# EAGLE design Main Board (EAGLE 5.11)
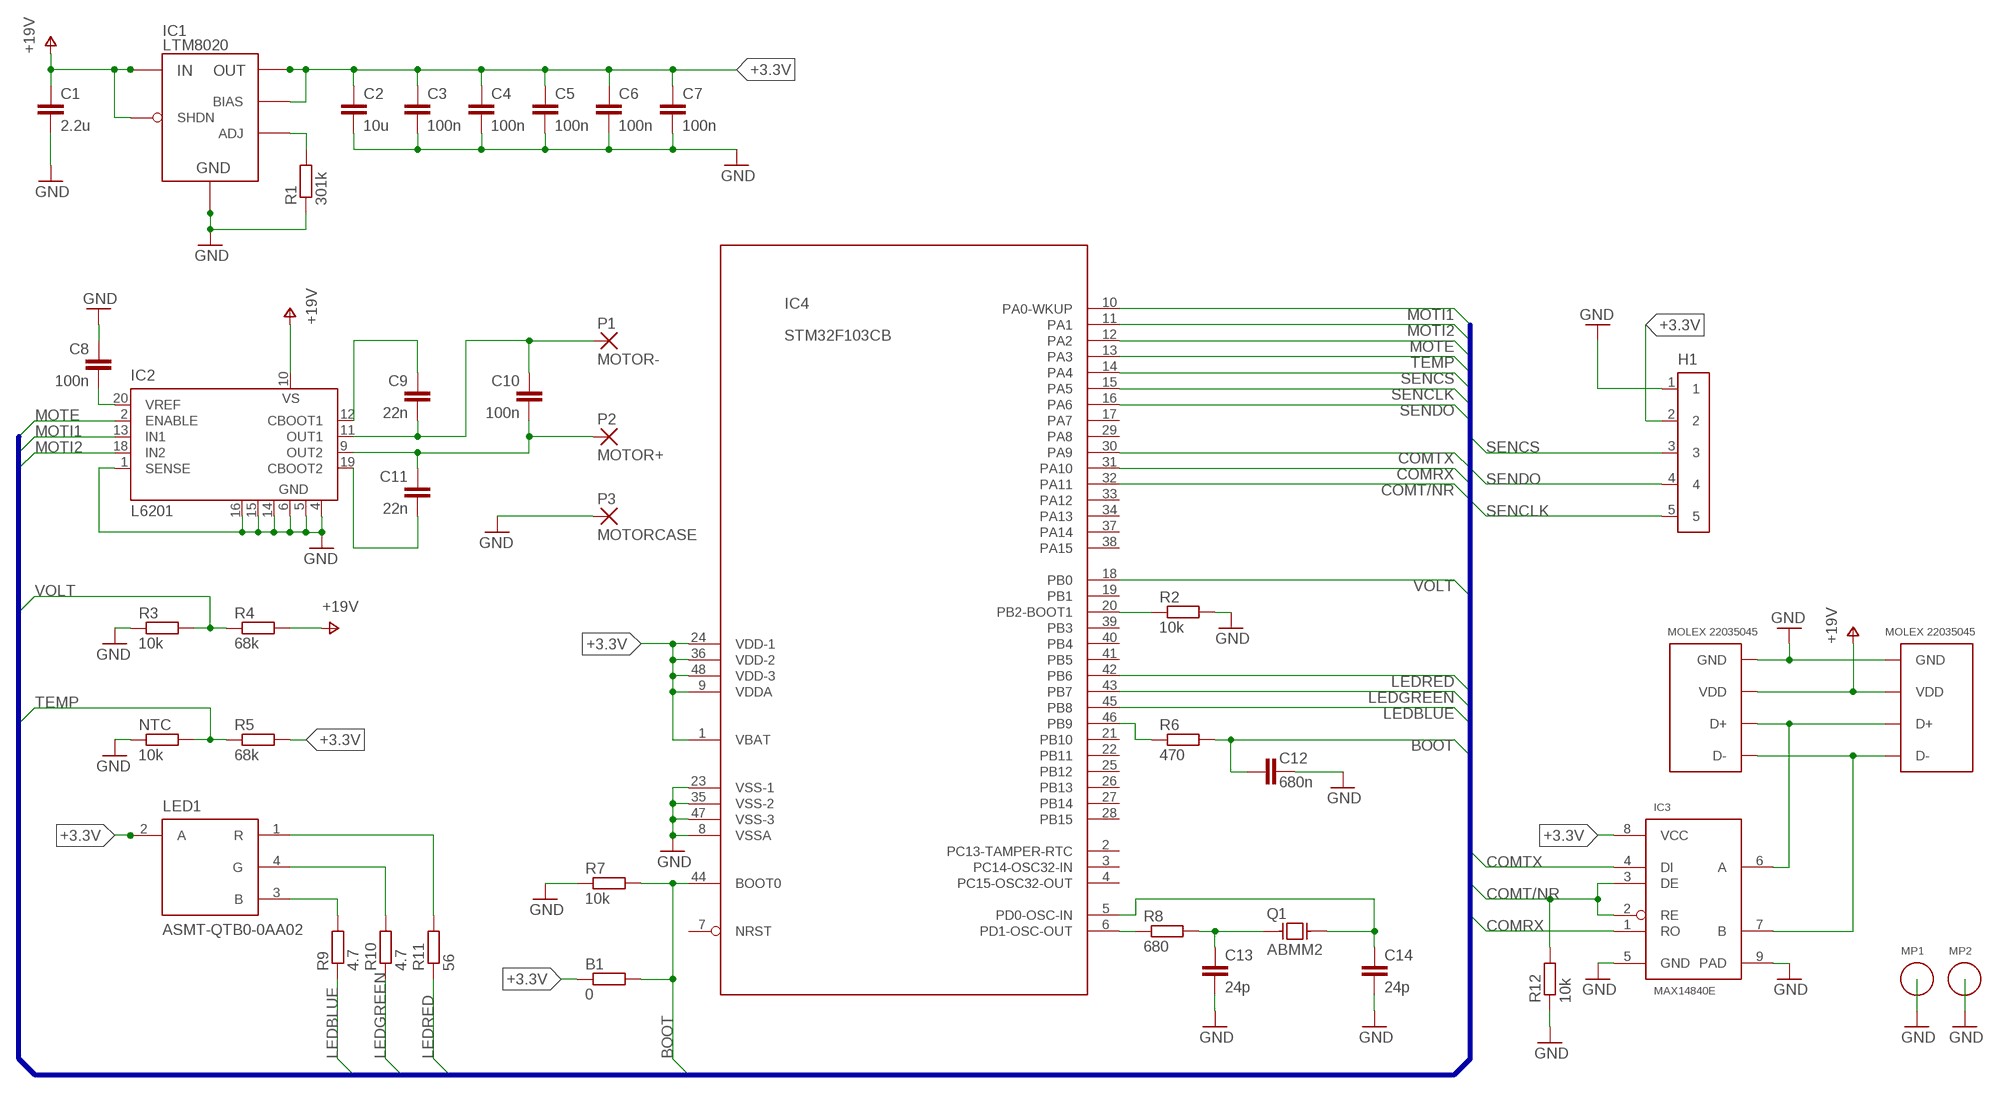
[diagram p0: schematic, sheet 1]

## Parts
B1  0  R-EU_R0603  [R0603]
C1  2.2u  C-EUC1206  [C1206]
C2  10u  C-EUC1206  [C1206]
C3  100n  C-EUC0402  [C0402]
C4  100n  C-EUC0402  [C0402]
C5  100n  C-EUC0402  [C0402]
C6  100n  C-EUC0402  [C0402]
C7  100n  C-EUC0402  [C0402]
C8  100n  C-EUC0402  [C0402]
C9  22n  C-EUC0402  [C0402]
C10  100n  C-EUC1206K  [C1206K]
C11  22n  C-EUC0402  [C0402]
C12  680n  C-EUC0603  [C0603]
C13  24p  C-EUC0402  [C0402]
C14  24p  C-EUC0402  [C0402]
H1  HEADER-M52  [HEADER-M52]
IC1  LTM8020  [LGA21]
IC2  L6201  [SO20]
IC3  MAX14840E  [TDFN8]
IC4  STM32F103CB  [LQFP48]
LED1  ASMT-QTB0-0AA02  [PLCC4]
MP1  MOUNTINGPAD-28  [PAD-2X4-ROUND]
MP2  MOUNTINGPAD-28  [PAD-2X4-ROUND]
NTC  10k  R-EU_R0603  [R0603]
P1  MOTOR-  PAD-2X3  [PAD-2X3]
P2  MOTOR+  PAD-2X3  [PAD-2X3]
P3  MOTORCASE  PAD-2X3  [PAD-2X3]
Q1  ABMM2  [CRYSTAL-6X3.6]
R1  301k  R-EU_R0603  [R0603]
R2  10k  R-EU_R0402  [R0402]
R3  10k  R-EU_R0402  [R0402]
R4  68k  R-EU_R0402  [R0402]
R5  68k  R-EU_R0402  [R0402]
R6  470  R-EU_R0402  [R0402]
R7  10k  R-EU_R0402  [R0402]
R8  680  R-EU_R0402  [R0402]
R9  4.7  R-EU_R0402  [R0402]
R10  4.7  R-EU_R0402  [R0402]
R11  56  R-EU_R0402  [R0402]
R12  10k  R-EU_R0402  [R0402]
U1  MOLEX22035045  [MOLEX22035045]
U2  MOLEX22035045  [MOLEX22035045]

## Nets
+3.3V [lowpower]: B1.1 C2.1 C3.1 C4.1 C5.1 C6.1 C7.1 H1.2 IC1.A4(OUT) IC1.A5(OUT) IC1.B4(OUT) IC1.B5(OUT) IC1.C3(BIAS) IC1.C4(OUT) IC1.C5(OUT) IC3.8(VCC) IC4.1(VBAT) IC4.9(VDDA) IC4.24(VDD-1) IC4.36(VDD-2) IC4.48(VDD-3) LED1.2(A) LED1.SINK1(A) LED1.SINK2(A) R5.2
BOOT: B1.2 C12.2 IC4.44(BOOT0) R6.2 R7.2
COMRX: IC3.1(RO) IC4.31(PA10)
COMT/NR: IC3.2(RE) IC3.3(DE) IC4.32(PA11) R12.2
COMTX: IC3.4(DI) IC4.30(PA9)
GND [gnd]: C1.2 C2.2 C3.2 C4.2 C5.2 C6.2 C7.2 C8.1 C12.1 C13.2 C14.2 H1.1 IC1.C2(GND) IC1.D1(GND) IC1.D2(GND) IC1.D3(GND) IC1.D4(GND) IC1.D5(GND) IC1.E2(GND) IC1.E3(GND) IC1.E4(GND) IC1.E5(GND) IC2.1(SENSE) IC2.4(GND) IC2.5(GND) IC2.6(GND) IC2.14(GND) IC2.15(GND) IC2.16(GND) IC3.5(GND) IC3.9(PAD) IC4.8(VSSA) IC4.23(VSS-1) IC4.35(VSS-2) IC4.47(VSS-3) MP1.1 MP2.1 NTC.1 P3.1 R1.1 R2.2 R3.1 R7.1 R12.1 U1.GND U2.GND
LEDBLUE: IC4.45(PB8) R9.1
LEDGREEN: IC4.43(PB7) R10.1
LEDRED: IC4.42(PB6) R11.1
MOTE: IC2.2(ENABLE) IC4.12(PA2)
MOTI1: IC2.13(IN1) IC4.10(PA0-WKUP)
MOTI2: IC2.18(IN2) IC4.11(PA1)
N$1: IC4.20(PB2-BOOT1) R2.1
N$2: IC4.46(PB9) R6.1
N$3: LED1.3(B) R9.2
N$4 [lowpower]: IC1.E1(ADJ) R1.2
N$5: LED1.4(G) R10.2
N$6: LED1.1(R) R11.2
N$7: C14.1 IC4.5(PD0-OSC-IN) Q1.3
N$8: C13.1 Q1.1 R8.2
N$9: IC4.6(PD1-OSC-OUT) R8.1
N$10: C8.2 IC2.20(VREF)
N$12 [highpower]: C9.2 C10.1 IC2.11(OUT1) P1.1
N$13: IC3.7(B) U1.D- U2.D-
N$14: IC3.6(A) U1.D+ U2.D+
N$15 [lowpower]: C9.1 IC2.12(CBOOT1)
N$16 [lowpower]: C11.2 IC2.19(CBOOT2)
N$18 [highpower]: C10.2 C11.1 IC2.9(OUT2) P2.1
SENCLK: H1.5 IC4.15(PA5)
SENCS: H1.3 IC4.14(PA4)
SENDO: H1.4 IC4.16(PA6)
TEMP: IC4.13(PA3) NTC.2 R5.1
V+ [highpower]: C1.1 IC1.A1(IN) IC1.A2(IN) IC1.C1(SHDN) IC2.10(VS) R4.2 U1.VDD U2.VDD ; supply symbol labelled +19V
VOLT: IC4.18(PB0) R3.2 R4.1
Unconnected: IC4.2(PC13-TAMPER-RTC) IC4.3(PC14-OSC32-IN) IC4.4(PC15-OSC32-OUT) IC4.7(NRST) IC4.17(PA7) IC4.19(PB1) IC4.21(PB10) IC4.22(PB11) IC4.25(PB12) IC4.26(PB13) IC4.27(PB14) IC4.28(PB15) IC4.29(PA8) IC4.33(PA12) IC4.34(PA13) IC4.37(PA14) IC4.38(PA15) IC4.39(PB3) IC4.40(PB4) IC4.41(PB5)

## Buses
COMT/NR,COMTX,COMRX,MOTE,MOTI1,MOTI2,SENCS,SENCLK,SENDO,LEDRED,LEDGREEN,LEDBLUE,BOOT,TEMP,VOLT

## Library data of the parts
B1 NTC R1-R12 = rcl:R-EU_: RESISTOR, European symbol
C1-C14 = rcl:C-EU: CAPACITOR, European symbol
H1 = sim:HEADER-M52: HEADER M52
IC1 = sim:LTM8020: VOLTAGE REGULATOR LTM8020
IC2 = st-microelectronics:L620: DMOS FULL BRIDGE DRIVER
IC3 = sim:MAX14840E: TRANSCEIVER MAX14840E
IC4 = sim:STM32F103CB: CONTROLLER STM32F103CB
LED1 = sim:ASMT-QTB0-0AA02: LED RGB ASMT-QTB0-0AA02
MP1 MP2 = sim:MOUNTINGPAD-28: MOUNTING PAD FOR DD-28
P1-P3 = sim:PAD-2X3: SMD PAD 2mm x 3mm
Q1 = sim:ABMM2: CERAMIC CRYSTAL ABMM2
U1 U2 = sim:MOLEX22035045: CONNECTOR MOLEX22035045

## Net classes
0 default: width 0.15 mm, drill 0.3 mm, clearance 0.15 mm
1 motor: width 0.3 mm, drill 0.3 mm, clearance 0.15 mm
2 highpower: width 0.3 mm, drill 0.3 mm, clearance 0.15 mm
3 lowpower: width 0.15 mm, drill 0.3 mm, clearance 0.15 mm
4 gnd: width 0.15 mm, drill 0.3 mm, clearance 0.15 mm

## Board
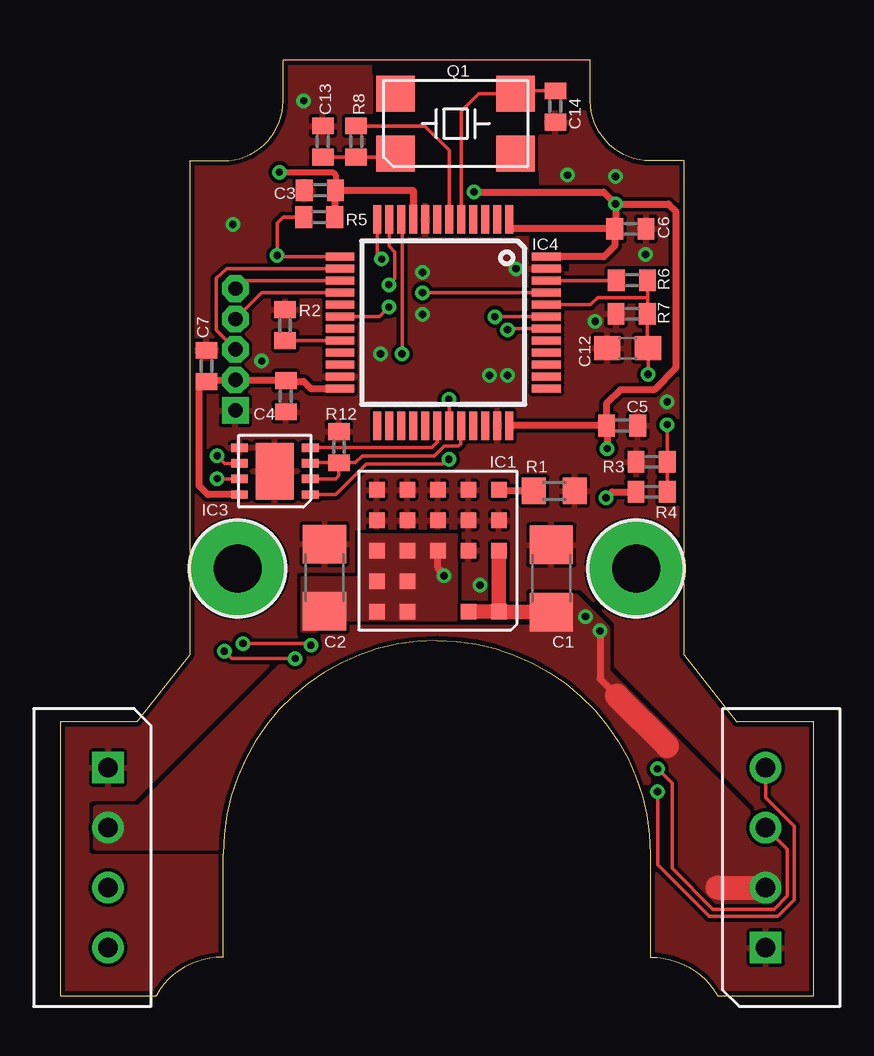
[diagram p1: board, top side]
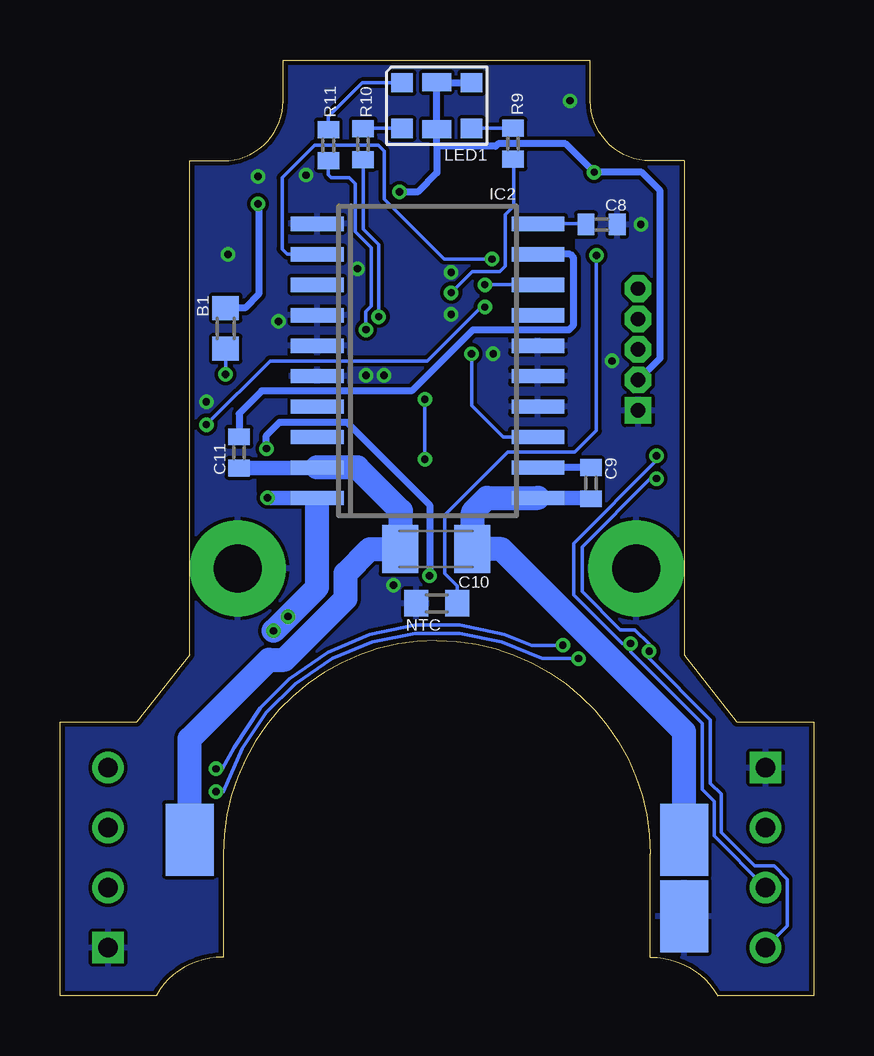
[diagram p2: board, bottom side, seen from below]

Size 31.4 x 39 mm. Coordinates in mm from the lower left corner, seen from the top.
Outline: 0,0 4,0 arc-61 6.8,1.6 6.8,5.9 arc-90 15.7,14.8 arc-90 24.6,5.9 24.6,1.6 arc-61 27.4,0 31.4,0 31.4,11.4 28.2,11.4 26,14.2 26,34.8 24.6,34.8 arc-90 22.1,37.3 22.1,39 9.3,39 9.3,37.3 arc-90 6.8,34.8 5.4,34.8 5.4,14.2 3.2,11.4 0,11.4 0,0
Copper layers (1*16): Top 0.035mm / dielectric 1.5mm / Bottom 0.035mm
Design rules "default *": minimum track width 0.15mm, minimum drill 0.3mm, track to track 0.15mm, track to pad 0.15mm, pad to pad 0.15mm, via to via 0.15mm, smd to smd 0.15mm, copper to edge 0.2mm, drill to drill 0.3mm, minimum pad ring 10mil, minimum via ring 6mil, stop-mask expansion 4mil, vias tented up to drill 0mil, thermal gap 0.15mm
tRestrict: area 10.7,33.4 to 10.8,33.8; area 15,33 to 15.4,33.1; area 24.9,30.3 to 25.4,30.4; area 23.6,30.3 to 24.1,30.4; area 20.9,30.2 to 21.2,30.4; area 12.8,35.4 to 12.9,35.8; area 19.6,31 to 19.6,31.7; area 5.8,26.3 to 6.4,26.4; area 13,38.4 to 13.1,38.8; area 20.1,36.2 to 20.1,36.6; area 19.9,33.8 to 19.9,34.3; area 12.8,36.7 to 13.2,36.8; 2 more areas
bRestrict: area 21.9,25.6 to 22.2,26; area 23.1,21 to 23.2,21.5; area 8.7,21.1 to 8.8,21.6; area 9.9,31.1 to 10.1,31.6; area 9.1,35.7 to 10.2,35.8; area 15.8,16.1 to 16,16.6

### Footprints (pad centres in the part's own frame; a part is rotated, then mirrored left to right if it is on the bottom)
R0603 = smd 1 x 1.1: 1 -0.85,0; 2 0.85,0
C1206 = smd 1.6 x 1.8: 1 -1.4,0; 2 1.4,0
C0402 = smd 0.7 x 0.9: 1 -0.65,0; 2 0.65,0
C1206K = smd 1.5 x 2: 1 -1.5,0; 2 1.5,0
C0603 = smd 1.1 x 1: 1 -0.85,0; 2 0.85,0
HEADER-M52 = drill 0.6 square: 1 -2.54,0 | drill 0.6 octagon: 2 -1.27,0; 3 0,0; 4 1.27,0; 5 2.54,0
LGA21 = smd 0.635 x 0.635: A1 2.54,-2.54; A2 1.27,-2.54; A4 -1.27,-2.54; A5 -2.54,-2.54; B4 -1.27,-1.27; B5 -2.54,-1.27; C1 2.54,0; C2 1.27,0; C3 0,0; C4 -1.27,0; C5 -2.54,0; D1 2.54,1.27; D2 1.27,1.27; D3 0,1.27; D4 -1.27,1.27; D5 -2.54,1.27; E1 2.54,2.54; E2 1.27,2.54; E3 0,2.54; E4 -1.27,2.54; E5 -2.54,2.54
SO20 = smd 0.6 x 2.2: 1 -5.715,-4.6; 2 -4.445,-4.6; 3 -3.175,-4.6; 4 -1.905,-4.6; 5 -0.635,-4.6; 6 0.635,-4.6; 7 1.905,-4.6; 8 3.175,-4.6; 9 4.445,-4.6; 10 5.715,-4.6; 11 5.715,4.6; 12 4.445,4.6; 13 3.175,4.6; 14 1.905,4.6; 15 0.635,4.6; 16 -0.635,4.6; 17 -1.905,4.6; 18 -3.175,4.6; 19 -4.445,4.6; 20 -5.715,4.6
TDFN8 = smd 0.35 x 0.7: 1 -0.975,-1.475; 2 -0.325,-1.475; 3 0.325,-1.475; 4 0.975,-1.475; 5 0.975,1.475; 6 0.325,1.475; 7 -0.325,1.475; 8 -0.975,1.475 | smd 2.35 x 1.58: 9 0,0
LQFP48 = smd 1.2 x 0.32: 1 -4.3,2.75; 2 -4.3,2.25; 3 -4.3,1.75; 4 -4.3,1.25; 5 -4.3,0.75; 6 -4.3,0.25; 7 -4.3,-0.25; 8 -4.3,-0.75; 9 -4.3,-1.25; 10 -4.3,-1.75; 11 -4.3,-2.25; 12 -4.3,-2.75; 25 4.3,-2.75; 26 4.3,-2.25; 27 4.3,-1.75; 28 4.3,-1.25; 29 4.3,-0.75; 30 4.3,-0.25; 31 4.3,0.25; 32 4.3,0.75; 33 4.3,1.25; 34 4.3,1.75; 35 4.3,2.25; 36 4.3,2.75 | smd 0.32 x 1.2: 13 -2.75,-4.3; 14 -2.25,-4.3; 15 -1.75,-4.3; 16 -1.25,-4.3; 17 -0.75,-4.3; 18 -0.25,-4.3; 19 0.25,-4.3; 20 0.75,-4.3; 21 1.25,-4.3; 22 1.75,-4.3; 23 2.25,-4.3; 24 2.75,-4.3; 37 2.75,4.3; 38 2.25,4.3; 39 1.75,4.3; 40 1.25,4.3; 41 0.75,4.3; 42 0.25,4.3; 43 -0.25,4.3; 44 -0.75,4.3; 45 -1.25,4.3; 46 -1.75,4.3; 47 -2.25,4.3; 48 -2.75,4.3
PLCC4 = smd 0.8 x 0.9: 1 -0.95,-1.45; 2 -0.95,1.45; 3 0.95,1.45; 4 0.95,-1.45 | smd 0.75 x 1.2: SINK1 -0.975,0; SINK2 0.975,0
PAD-2X4-ROUND = drill 2 pad 4 round: 1 0,0
PAD-2X3 = smd 3 x 2: 1 0,0
CRYSTAL-6X3.6 = smd 1.6 x 1.5: 1 -2.5,-1.25; 2 2.5,-1.25; 3 2.5,1.25; 4 -2.5,1.25
R0402 = smd 0.7 x 0.9: 1 -0.65,0; 2 0.65,0
MOLEX22035045 = drill 0.8 round: D+ 7.45,3.1; D- 9.95,3.1; VDD 4.95,3.1 | drill 0.8 square: GND 2.45,3.1

### Placement (x,y rotation side)
B1  24.5,27.81 270 bottom
C1  20.47,17.38 90 top
C2  11.02,17.42 90 top
C3  10.83,33.57 180 top
C4  9.41,24.98 270 top
C5  23.42,23.76 0 top
C6  23.77,31.96 0 top
C7  6.1,26.25 90 top
C8  8.83,32.14 180 bottom
C9  9.28,21.36 270 bottom
C10  15.73,18.61 180 bottom
C11  23.94,22.64 90 bottom
C12  23.65,26.98 0 top
C13  10.95,35.6 90 top
C14  20.64,37.06 270 top
H1  7.31,26.93 90 top
IC1  15.75,18.54 0 top
IC2  16.08,26.46 270 bottom
IC3  8.95,21.86 90 top
IC4  15.97,28.05 270 top
LED1  15.7,37.1 270 bottom
MP1  7.4,17.8 0 top
MP2  24,17.8 0 top
NTC  15.7,16.35 0 bottom
P1  5.4,6.5 90 bottom
P2  26,6.5 90 bottom
P3  5.4,3.3 90 bottom
Q1  16.49,36.35 0 top
R1  20.6,21.04 180 top
R2  9.38,27.95 90 top
R3  24.65,22.25 0 top
R4  24.65,21 180 top
R5  10.8,32.45 0 top
R6  23.83,29.82 0 top
R7  23.82,28.42 0 top
R8  12.34,35.6 270 top
R9  12.52,35.51 90 bottom
R10  18.77,35.49 90 bottom
R11  20.22,35.45 90 bottom
R12  11.62,22.86 270 top
U1  32.5,-0.45 90 top
U2  -1.1,11.95 270 top

### Tracks (layer width: path | path; a pad name or v marks a point on that pad's centre or on a via)
+3.3V  (via drill 0.3)
  Top 0.25: v9.14,34.32 11.37,34.32 11.48,34.21 C3.1
  Top 0.3: IC4.48 22.65,30.8 23.12,31.27 C6.1 | C6.1 23.1,31.94 | IC4.1 18.72,31.96 C6.1 | IC4.36 C5.1 | IC3.8 6.17,20.89 5.8,21.25 5.8,25.3 C7.1 6.16,25.66 H1.2 9.38,25.66 C4.1 9.44,25.6 10.15,25.6 10.45,25.3 IC4.24 | R5.2 11.45,33.56 C3.1 14.72,33.57 IC4.9 | v17.25,33.5 22.65,33.5 v23.15,33 | v22.8,22.8 22.8,23.75 22.81,23.76 C5.1 | v16,17.5 15.75,17.85 IC1.C3 | C5.1 22.77,24.67 23.35,25.25 24.75,25.25 25.65,26.15 25.65,32.7 25.35,33 v23.15,33 | C6.1 23.15,31.99 v23.15,33
  Bottom 0.3: LED1.2 15.68,38.05 LED1.SINK1 LED1.SINK2 15.7,35.4 | 15.7,35.4 15.7,34.3 16.5,33.5 v17.25,33.5 | 15.7,35.4 13.25,35.4 13.14,35.51 10.33,35.51 v9.14,34.32 7.17,34.32 6.4,33.55 6.4,26.57 H1.2 | v22.8,22.8 22.8,23.35 22.25,23.9 19.45,23.9 16,20.45 v16,17.5 | v23.15,33 23.12,32.97 23.12,29.23 23.69,28.66 B1.1
  pour Top (rank 2, no thermals): 10.1,15.2 12,15.2 12,15.6 16.5,15.6 16.5,18 16.5,19.2 12.5,19.2 12.5,17.4 10.1,17.4
BOOT  (via drill 0.3)
  Top 0.15: IC4.44 22.1,28.8 22.4,29.1 24.48,29.1 | 24.48,29.1 R6.2 | 24.48,29.1 R7.2 24.47,27.01 C12.2 v24.5,25.9
  Bottom 0.15: v24.5,25.9 B1.2
COMRX  (via drill 0.3)
  Top 0.15: IC3.1 11.48,20.89 12.75,22.15 15.95,22.15 v16.2,22.35 | IC4.31 16.22,24.83 v16.2,24.85
  Bottom 0.15: v16.2,22.35 v16.2,24.85
COMT/NR
  Top 0.15: IC3.3 10.45,22.21 R12.2 | IC3.2 11.48,21.54 11.62,21.67 R12.2 | R12.2 12.31,22.21 12.6,22.5 15.6,22.5 16,22.9 16.6,22.9 16.7,23 16.7,23.74 IC4.32
COMTX
  Top 0.15: IC3.4 15.48,22.84 15.72,23.07 IC4.30
GND  (via drill 0.3)
  other vias: 19,30.3 24.4,30.9 21.15,34.2 23.15,34.15 10.15,37.3 7.2,32.15 15.1,30.15 15.1,28.4 13.35,26.75 18.65,25.85 17.9,25.85 17.5,17.1 25.3,24.75 22.3,28.1 8.4,26.45
  pour Top (rank 3): 0,0 31.4,0 31.4,6.5 31.4,39 11.1,39 0,39
  pour Bottom (rank 3): 0,0 31.4,0 31.4,39 0,39
LEDBLUE  (via drill 0.3)
  Top 0.15: IC4.45 v15.1,29.3
  Bottom 0.15: R9.1 12.5,34.84 12.5,32.9 12.85,32.55 12.85,30.4 13.08,30.17 14.23,30.17 v15.1,29.3
LEDGREEN  (via drill 0.3)
  Top 0.15: v18.12,28.3 IC4.43
  Bottom 0.15: R10.1 18.77,31.95 18.12,31.3 v18.12,28.3
LEDRED  (via drill 0.3)
  Top 0.15: IC4.42 20.26,27.81 18.7,27.81 v18.65,27.76
  Bottom 0.15: 18.66,27.82 v18.65,27.76 v18.66,27.77 18.66,28.52 18.43,28.75 18.43,31.17 19.1,31.84 19.1,33.85 19.35,34.1 20.1,34.1 20.22,34.22 R11.1
MOTE  (via drill 0.3)
  Top 0.15: IC4.12 13.22,30.88 v13.4,30.7
  Bottom 0.15: IC2.2 21.93,30.9 22.15,31.12 22.15,34.09 20.79,35.45 18.15,35.45 17.9,35.2 17.9,33.2 15.4,30.7 v13.4,30.7
MOTI1  (via drill 0.3)
  Top 0.15: IC4.10 14.25,32.35 v14.25,26.75
  Bottom 0.15: v14.25,26.75 14.25,24.6 12.93,23.28 IC2.13
MOTI2  (via drill 0.3)
  Top 0.15: IC4.11 13.72,31.23 13.95,31 13.95,29.88 v13.7,29.63
  Bottom 0.15: IC2.18 v13.7,29.63
N$1
  Top 0.15: IC4.20 R2.1
N$2
  Top 0.15: IC4.46 23.18,29.8 R6.1
N$3
  Bottom 0.15: LED1.3 R9.2
N$4
  Top 0.3: IC1.E1 arc90 18.33,21.04 R1.2
N$5
  Bottom 0.15: LED1.4 R10.2
N$6
  Bottom 0.15: LED1.1 18.8,38.05 20.22,36.63 R11.2
N$7
  Top 0.15: C14.1 19.23,37.71 Q1.3 17.45,37.6 16.72,36.87 IC4.5
N$8
  Top 0.15: Q1.1 13.77,34.95 R8.2 C13.1
N$9
  Top 0.15: R8.1 15.2,36.25 16.22,35.23 IC4.6
N$10
  Bottom 0.15: IC2.20 9.21,32.17 C8.2
N$12
  Bottom 0.6: C9.2 9.31,20.74 IC2.11
  Bottom 1: IC2.11 13.61,20.74 14.2,20.15 14.2,18.64 C10.1 13.01,18.61 5.4,11 P1.1
N$13  (via drill 0.3)
  Top 0.15: IC3.7 6.57,21.54 arc-90 v6.55,21.55 | U1.D- 29.4,8.25 30.6,7.05 30.6,4 29.9,3.3 27.05,3.3 24.9,5.45 v24.9,8.5 | v9.8,14.05 7.15,14.05 v6.85,14.35
  Bottom 0.15: v6.55,21.55 6.8,21.55 9.65,18.7 9.65,16.85 8.05,15.25 7.45,15.25 6.85,14.65 v6.85,14.35 6.85,14.05 4.3,11.5 4.3,8.85 3.85,8.4 3.85,6.8 2.45,5.4 1.65,5.4 1.1,4.85 1.1,2.9 U2.D- | v24.9,8.5 24.6,8.5 23.8,10.3 22.8,11.8 21.6,13 20.05,14.05 18.4,14.75 16.6,15.1 14.75,15.1 13,14.75 11.3,14.05 v9.8,14.05
N$14  (via drill 0.3)
  Top 0.15: IC3.6 6.87,22.18 v6.55,22.5 | U1.D+ 30.3,6.1 30.3,4.15 29.75,3.6 27.2,3.6 25.5,5.3 25.5,8.85 v24.9,9.45 | v10.45,14.6 10.43,14.68 v7.62,14.68
  Bottom 0.15: v6.55,22.5 6.55,22.3 10,18.85 10,16.7 7.97,14.68 v7.62,14.68 7.62,14.32 4.65,11.35 4.65,8.6 4.15,8.1 4.15,6.65 U2.D+ | v24.9,9.45 24.65,9.45 24.15,10.35 23.05,12 21.85,13.2 20.25,14.3 18.5,15.05 16.6,15.45 14.75,15.45 12.9,15.05 11.75,14.6 v10.45,14.6
N$15
  Bottom 0.3: IC2.12 C9.1
N$16
  Bottom 0.3: C11.2 23.94,24.26 23,25.2 16.75,25.2 14.2,27.75 10.2,27.75 10,27.95 10,30.75 10.15,30.9 IC2.19
N$18
  Bottom 0.6: IC2.9 20.7,21.99 C11.1
  Bottom 1: IC2.9 19.01,22.01 17.2,20.2 17.2,18.64 C10.2 18.49,18.61 19.5,17.6 19.5,16.55 22.05,14 22.7,14 26,10.7 P2.1
SENCLK
  Top 0.15: IC4.15 7.64,29.8 H1.5
SENCS
  Top 0.15: IC4.14 6.95,30.3 6.5,29.9 6.5,27.74 H1.3
SENDO
  Top 0.15: IC4.16 8.41,29.3 H1.4
TEMP  (via drill 0.3)
  Top 0.15: 10.85,30.8 IC4.13 9.05,30.8 v9.05,30.85 9.05,32.2 9.3,32.45 R5.1
  Bottom 0.15: NTC.2 14.85,17.08 15.37,17.6 15.37,20.03 12.75,22.65 9.95,22.65 9.05,23.55 v9.05,30.85
V+  (via drill 0.3)
  Top 0.3: 23.2,12.5 22.5,13.2 v22.5,15.2 | R4.2 23,21 v22.75,20.75
  Top 0.6: IC1.A2 IC1.A1 | C1.1 18.31,15.98 IC1.A1 | IC1.A1 IC1.C1
  Top 1: 27.4,4.5 U1.VDD | 23.2,12.5 25.3,10.4
  Bottom 0.3: IC2.10 20.7,20.74
  Bottom 0.6: 20.68,20.2 20.7,20.2 | 20.68,20.25 IC2.10 v22.75,20.74 v22.75,20.75
  Bottom 1: v22.5,15.2 20.68,17.02 20.68,20.2 20.68,20.25 20.68,20.45
  other vias: 21.9,15.8
  pour Top (no thermals): 3.3,7.8 1.5,7.8 1.5,6.2 7.3,6.2 25,6 26.7,3.8 30.2,3.7 30.2,6.1 22.8,13.5 22.8,15.3 21.5,16.6 19.8,16.6 19.8,15.3 10.8,15.3
VOLT  (via drill 0.3)
  Top 0.15: R4.1 R3.2 v25.3,23.8 | IC4.18 13.3,28.3 v13.7,28.7
  Bottom 0.15: v25.3,23.8 22.65,26.45 16.1,26.45 13.85,28.7 v13.7,28.7

### Text on the board
tNames: Q1